# EAGLE design RedCarMotorControllerBoard (EAGLE 7.2.0)
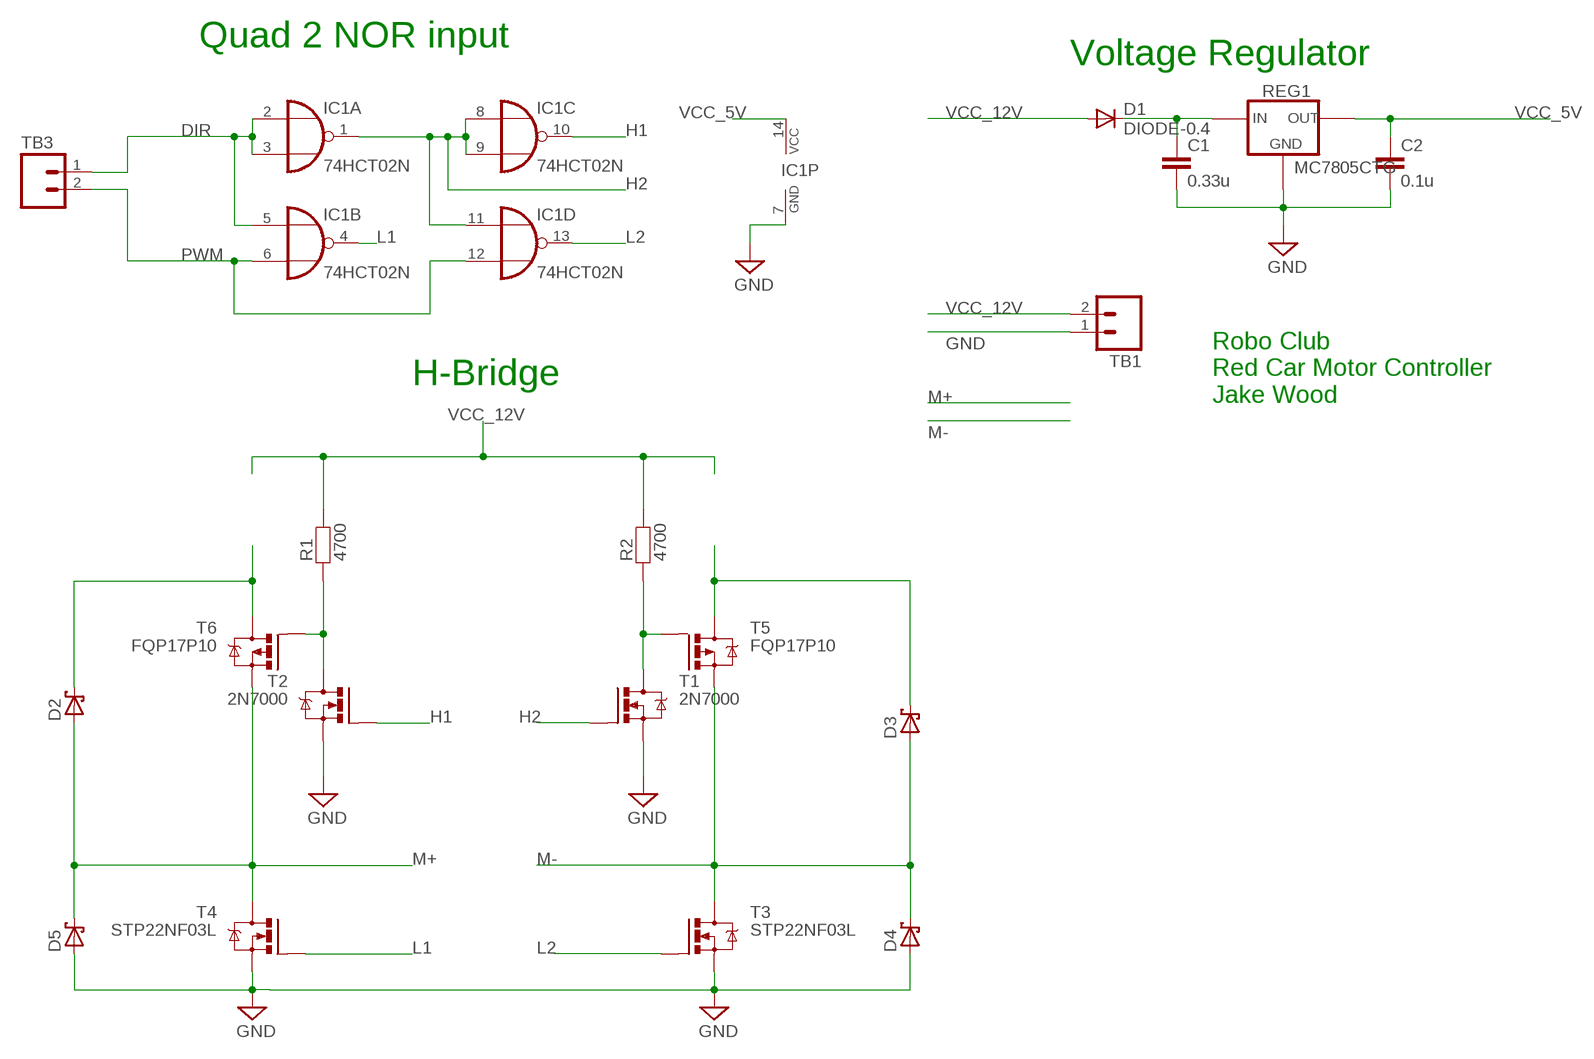
[diagram p0: schematic, sheet 1]

## Parts
C1  0.33u  CAPACITOR-RADIAL-0.2  [RADIAL-0.2]
C2  0.1u  CAPACITOR-RADIAL-0.2  [RADIAL-0.2]
D1  DIODE-0.4  [DIODE-0.4]
D2  SCHOTTKY-DIODEDO201T15  [DO201T15]
D3  SCHOTTKY-DIODEDO201T15  [DO201T15]
D4  SCHOTTKY-DIODEDO201T15  [DO201T15]
D5  SCHOTTKY-DIODEDO201T15  [DO201T15]
IC1  74HCT02N  [DIL14]
R1  4700  RESISTOR-AXIAL-0.4  [AXIAL-0.4]
R2  4700  RESISTOR-AXIAL-0.4  [AXIAL-0.4]
REG1  MC7805CTG  [TO220-UPRIGHT]
T1  2N7000  [TO92-]
T2  2N7000  [TO92-]
T3  STP22NF03L  [TO220-UPRIGHT]
T4  STP22NF03L  [TO220-UPRIGHT]
T5  FQP17P10  [TO220-UPRIGHT]
T6  FQP17P10  [TO220-UPRIGHT]
TB1  KK-CONNECT-2WAY_PG  [KK-CONNECT-2WAY-PG]
TB3  KK-CONNECT-2WAY_PG  [KK-CONNECT-2WAY-PG]

## Nets
DIR: IC1.2(A:I0) IC1.3(A:I1) IC1.5(B:I0) TB3.1
GND: C1.P$2 C2.P$2 D4.A D5.A IC1.7(P:GND) REG1.2(GND) T1.3(S) T2.3(S) T3.3(S) T4.3(S) TB1.1
H1: IC1.10(C:O) T2.2(G)
H2: IC1.1(A:O) IC1.8(C:I0) IC1.9(C:I1) IC1.11(D:I0) T1.2(G)
L1: IC1.4(B:O) T4.1(G)
L2: IC1.13(D:O) T3.1(G)
M+: D2.A D5.C T4.2(D) T6.2(D)
M-: D3.A D4.C T3.2(D) T5.2(D)
N$1: C1.P$1 D1.C REG1.1(IN)
N$2: D3.C T5.3(S)
N$4: R1.P$1 T2.1(D) T6.1(G)
N$5: R2.P$1 T1.1(D) T5.1(G)
N$8: D2.C T6.3(S)
PWM: IC1.6(B:I1) IC1.12(D:I1) TB3.2
VCC_5V: C2.P$1 IC1.14(P:VCC) REG1.3(OUT)
VCC_12V: D1.A R1.P$2 R2.P$2 TB1.2

## Notes on the sheet
- Quad 2 NOR input
- Voltage Regulator
- H-Bridge
- Robo Club 
  Red Car Motor Controller
  Jake Wood

## Library data of the parts
C1 C2 = JCU:CAPACITOR: Capacitor
D1 = JCU:DIODE: Diode
D2-D5 = diode:SCHOTTKY-DIODE: Schottky Diode
IC1 = 74xx-eu:74*02: Quad 2-input NOR gate
R1 R2 = JCU:RESISTOR
REG1 = JCU:MC7805CTG: MC7805CTG: +5Volt voltage regulator. TO220 case
T1 T2 = JCU:2N7000: 2N7000 N-ch Power MOSFET 60V 5ohm 0.35A
T3 T4 = JCU:STP22NF03L: STP22NF03L: N-ch Power MOSFET 30V 0.0038ohm 22A TO220
T5 T6 = JCU:FQP17P10: QFP17P10: P-ch Power MOSFET 100V 0.19ohm -16.5A. TO220 package
TB1 TB3 = JCU:KK-CONNECT-2WAY_PG: KK Connector 2 way; 0.1". E14: Header 973-1148; Housing 143-126

## Board
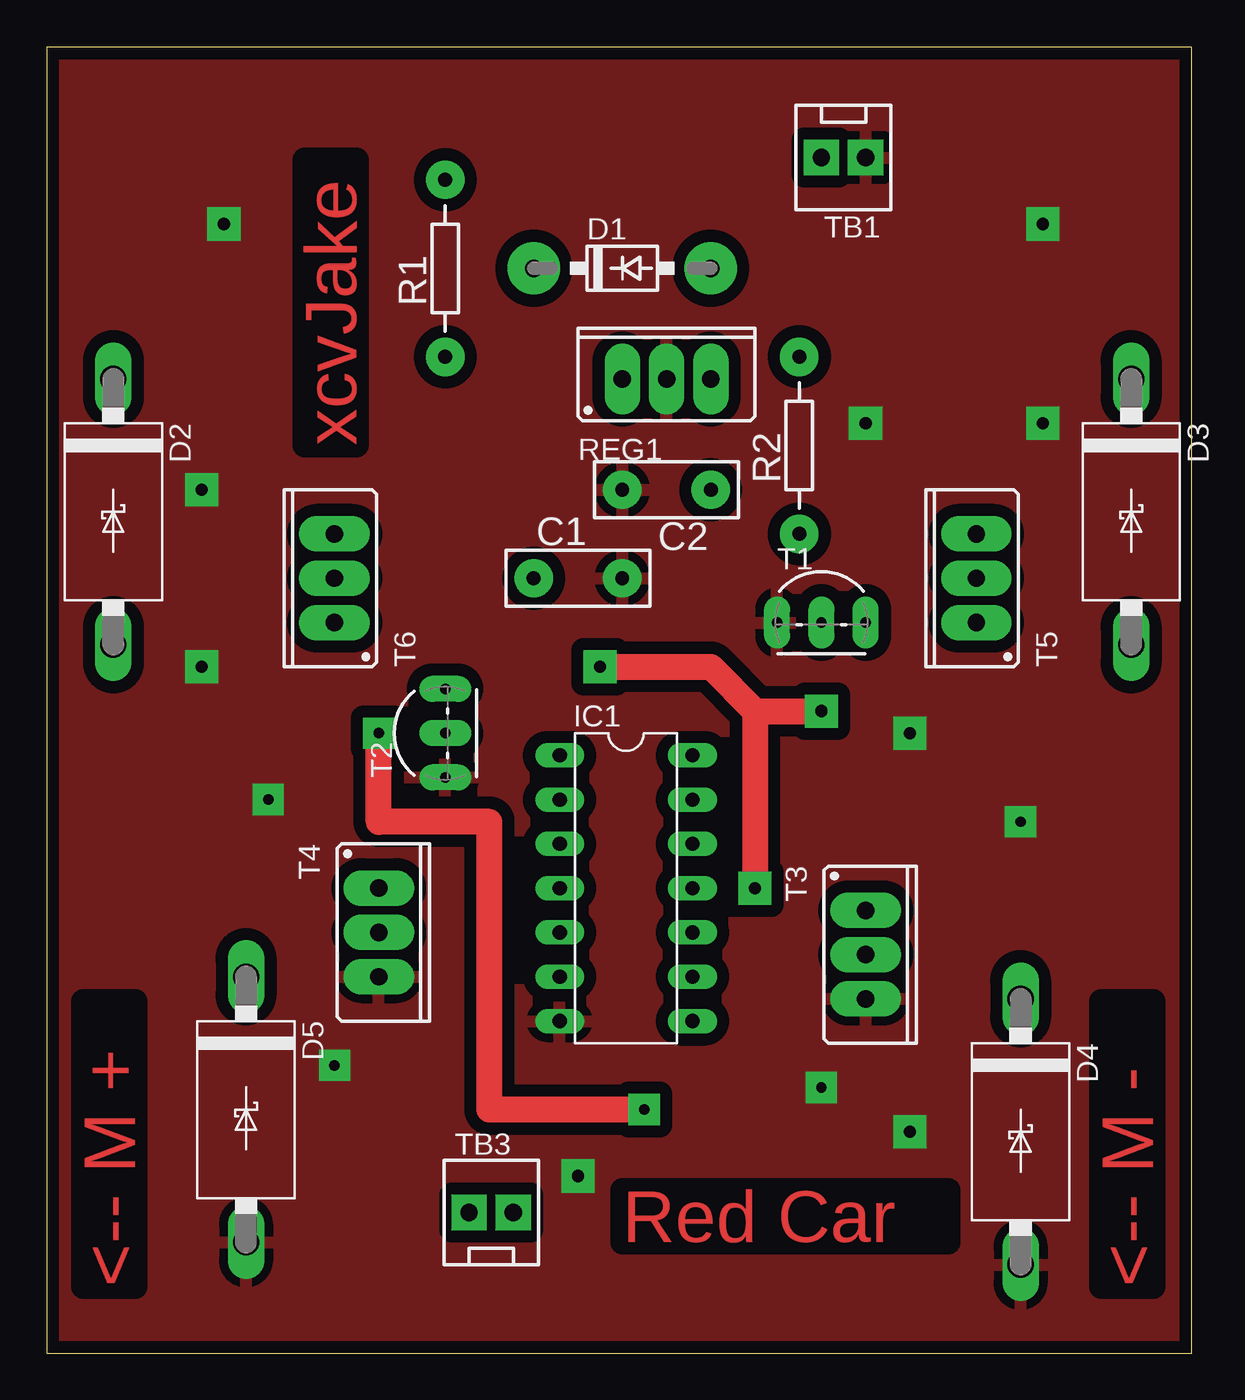
[diagram p1: board, top side]
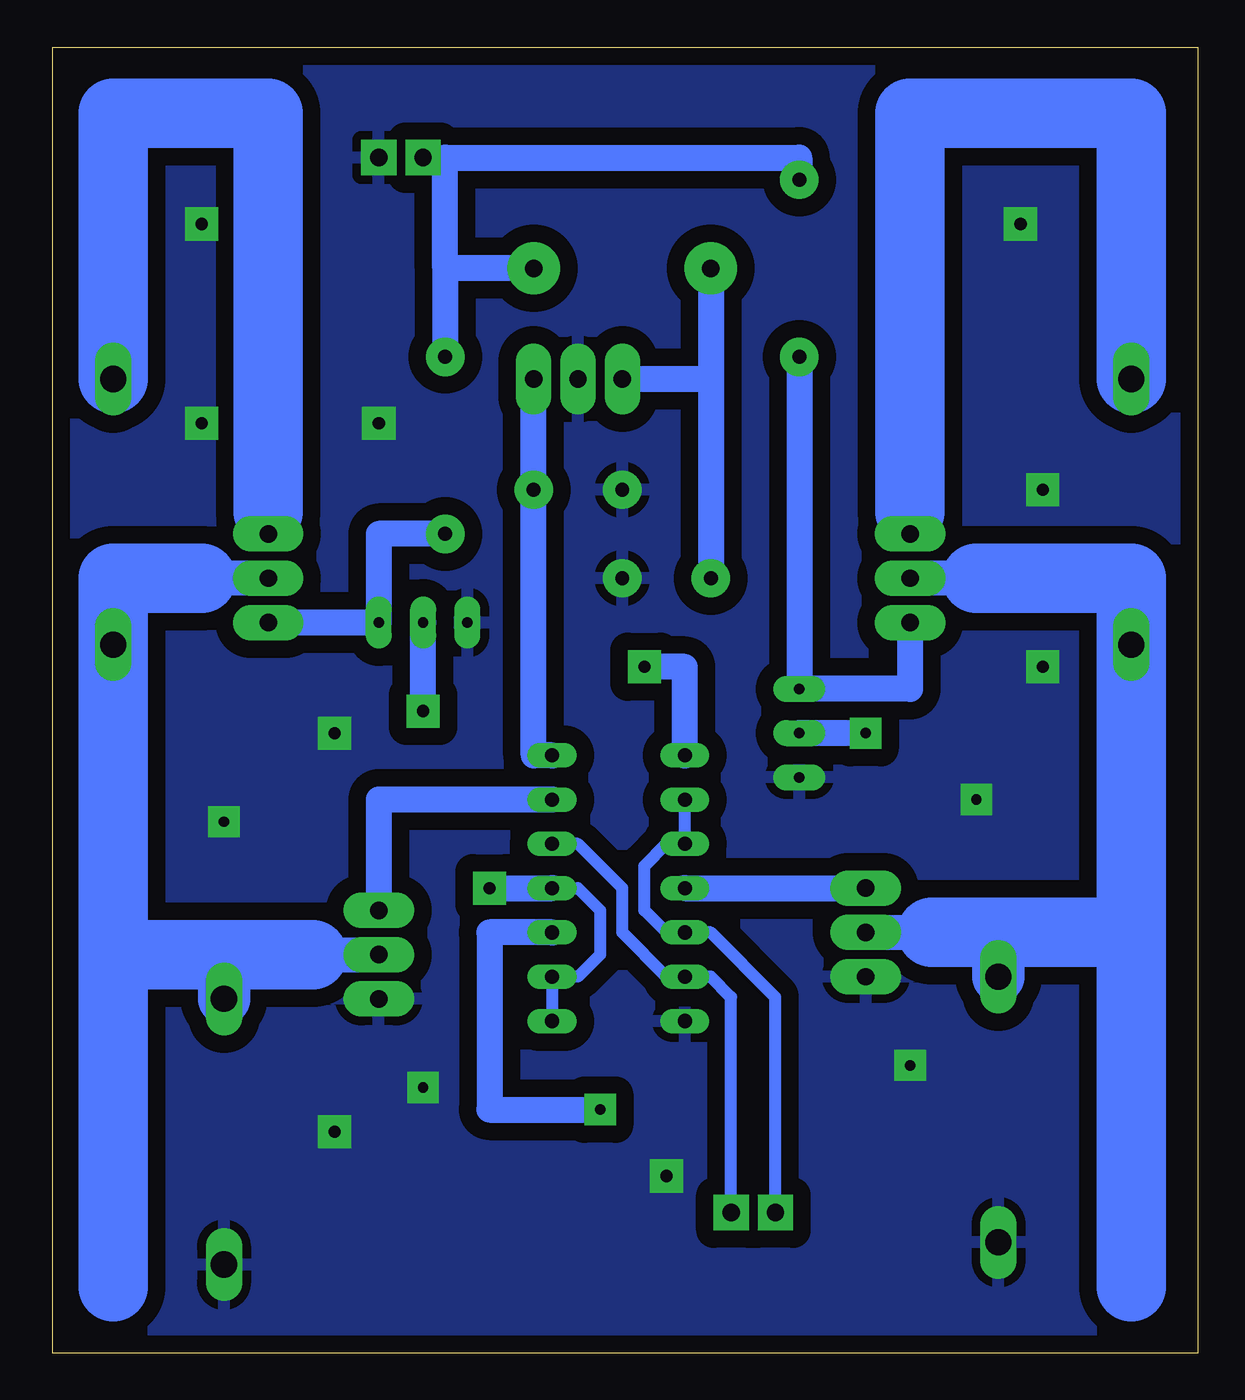
[diagram p2: board, bottom side, seen from below]

Size 65.71 x 74.92 mm. Coordinates in mm from the lower left corner, seen from the top.
Outline: 0,0 65.71,0 65.71,74.92 0,74.92 0,0
Copper layers (1*16): Top 0.035mm / dielectric 1.5mm / Bottom 0.035mm
Design rules "JCU-Mill-Mach": minimum track width 0.5mm, minimum drill 0.6mm, track to track 0.5mm, track to pad 0.5mm, pad to pad 0.5mm, via to via 0.5mm, smd to smd 0.5mm, copper to edge 0.5mm, drill to drill 0.5mm, minimum pad ring 0.3mm, minimum via ring 0.6mm, stop-mask expansion 4mil, vias tented up to drill 0mil, thermal gap 0.5mm

### Footprints (pad centres in the part's own frame; a part is rotated, then mirrored left to right if it is on the bottom)
RADIAL-0.2 = drill 0.8 pad 2.2: P$1 -2.54,0; P$2 2.54,0
DIODE-0.4 = drill 1 pad 3: A 5.08,0; C -5.08,0
DO201T15 = drill 1.499 long: A 7.62,0; C -7.62,0
DIL14 = drill 0.813 long: 1 -7.62,-3.81; 2 -5.08,-3.81; 3 -2.54,-3.81; 4 0,-3.81; 5 2.54,-3.81; 6 5.08,-3.81; 7 7.62,-3.81; 8 7.62,3.81; 9 5.08,3.81; 10 2.54,3.81; 11 0,3.81; 12 -2.54,3.81; 13 -5.08,3.81; 14 -7.62,3.81
AXIAL-0.4 = drill 0.8 pad 2.2: P$1 -5.08,0; P$2 5.08,0
TO220-UPRIGHT = drill 1 pad 2.032 long: 1 0,0; 2 2.54,0; 3 5.08,0
TO92- = drill 0.6 pad 1.5 long: 1 2.54,0; 2 0,0; 3 -2.54,0
KK-CONNECT-2WAY-PG = drill 1 pad 2.032 square: 1 0,0; 2 2.54,0

### Placement (x,y rotation side)
C1  30.48,44.45 0 top
C2  35.56,49.53 180 top
D1  33.02,62.23 0 top
D2  3.81,48.26 270 top
D3  62.23,48.26 270 top
D4  55.88,12.7 270 top
D5  11.43,13.97 270 top
IC1  33.24,26.67 270 top
R1  22.86,62.23 90 top
R2  43.18,52.07 90 top
REG1  33.02,55.88 0 top
T1  44.45,41.91 0 top
T2  22.86,35.56 90 top
T3  46.99,25.4 270 top
T4  19.05,26.67 270 top
T5  53.34,41.91 90 top
T6  16.51,41.91 90 top
TB1  46.99,68.58 180 top
TB3  24.23,8.06 0 top

### Tracks (layer width: path | path; a pad name or v marks a point on that pad's centre or on a via)
DIR
  Bottom 0.7: IC1.2 IC1.3 30.48,29.21 31.75,27.94 31.75,25.4 30.48,24.13 IC1.5 27.94,24.13 24.23,20.42 TB3.1
GND  (via drill 0.6, 0.7)
  other vias: 46.99,53.34 49.53,35.56 49.53,12.7 30.48,10.16 8.89,39.37 12.7,31.75 16.51,16.51 55.88,30.48 44.45,15.24 57.15,64.77 57.15,53.34 10.16,64.77 8.89,49.53
  pour Bottom (isolate 1): -1.27,76.2 101.6,76.2 101.6,-1.27 -1.27,-1.27
  pour Top (isolate 0.7): -1.27,76.2 72.39,76.2 72.39,-1.27 -1.27,-1.27
H1  (via drill 0.6)
  Top 1.5: v34.29,13.97 25.4,13.97 25.4,30.48 19.05,30.48 v19.05,35.56
  Bottom 1.5: IC1.10 40.64,24.13 40.64,13.97 v34.29,13.97 | v19.05,35.56 T2.2
H2  (via drill 0.7)
  Top 1.5: v31.75,39.37 38.1,39.37 40.64,36.83 | 40.64,36.83 v40.64,26.67 | 40.64,36.83 v44.45,36.83
  Bottom 0.7: IC1.11 35.56,26.67 34.29,25.4 34.29,22.86 35.56,21.59 IC1.9 IC1.8
  Bottom 1.5: IC1.1 29.43,39.37 v31.75,39.37 | v40.64,26.67 IC1.11 | v44.45,36.83 T1.2
L1
  Bottom 1.5: IC1.4 T4.1
L2
  Bottom 1.5: IC1.13 46.99,31.75 T3.1
M+
  Bottom 2: 12.7,44.45 T6.2 | T4.2 15.24,24.13
  Bottom 3: D5.C 11.43,24.13
  Bottom 4: 12.7,44.45 3.81,44.45 D2.A 3.81,24.13 | 3.81,24.13 3.81,3.81 | 3.81,24.13 11.43,24.13 15.24,24.13
M-
  Bottom 2: T5.2 57.15,44.45 | 50.8,22.86 T3.2
  Bottom 3: D4.C 55.88,22.86
  Bottom 4: 57.15,44.45 62.23,44.45 D3.A 62.23,22.86 | 62.23,3.81 62.23,22.86 | 50.8,22.86 55.88,22.86 62.23,22.86
N$1
  Bottom 1.5: D1.C 27.94,55.88 | 27.94,55.88 C1.P$1 | REG1.1 27.94,55.88
N$2
  Bottom 2: 53.34,48.26 T5.3
  Bottom 4: D3.C 62.23,71.12 53.34,71.12 53.34,48.26
N$4
  Bottom 1.5: R1.P$1 T2.1 16.51,38.1 T6.1
N$5
  Bottom 1.5: T5.1 T1.1 46.99,46.99 R2.P$1
N$8
  Bottom 2: 16.51,48.26 T6.3
  Bottom 4: D2.C 3.81,71.12 16.51,71.12 16.51,48.26
PWM
  Bottom 0.7: IC1.12 35.56,29.21 33.02,26.67 33.02,24.13 30.48,21.59 IC1.6 27.94,21.59 26.77,20.42 TB3.2
VCC_5V
  Bottom 1.5: REG1.3 C2.P$1 38.1,34.29 IC1.14
VCC_12V
  Bottom 1: 43.18,68.58 TB1.2
  Bottom 1.5: D1.A 43.18,62.23 | 43.18,62.23 R2.P$2 | 43.18,62.23 43.18,68.58 22.86,68.58 R1.P$2

### Text on the board
Top: xcvJake | Red Car | <-- M + | <-- M -